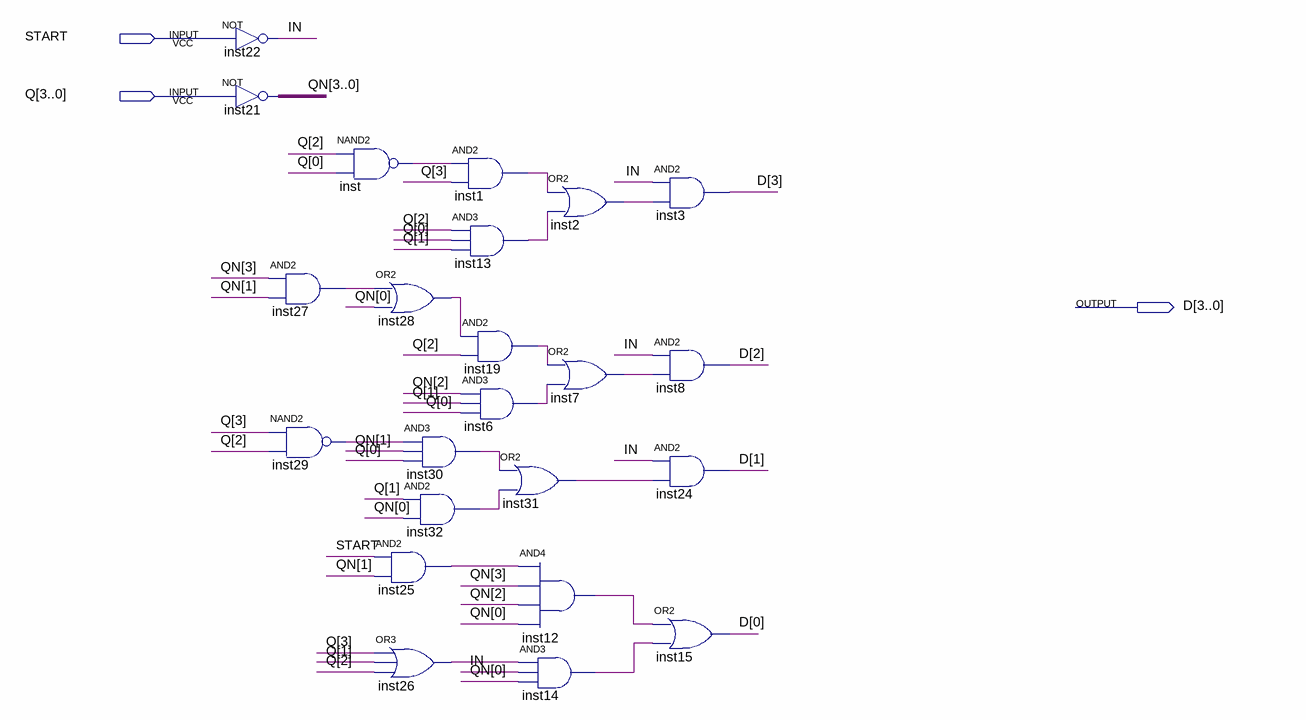
[diagram p0: schematic sheet]
// Quartus schematic NEXTSTATE.bdf as structural Verilog: 23 symbols, 3 pins
module NEXTSTATE (
  input  START,
  input  [3:0] Q,
  output [3:0] D
);

  wire IN, inst1_out, inst2_out, inst6_out, inst7_out, inst12_out, inst13_out, inst14_out, inst19_out,
       inst25_out, inst26_out, inst27_out, inst28_out, inst29_out, inst30_out, inst31_out, inst32_out,
       inst_out;
  wire [3:0] QN;

  not inst22 (IN, START);
  assign QN = ~Q;  // NOT inst21, 4 bits wide
  and inst27 (inst27_out, QN[3], QN[1]);
  nand inst29 (inst29_out, Q[3], Q[2]);
  nand inst (inst_out, Q[2], Q[0]);
  or inst28 (inst28_out, inst27_out, QN[0]);
  and inst30 (inst30_out, inst29_out, QN[1], Q[0]);
  and inst32 (inst32_out, Q[1], QN[0]);
  and inst25 (inst25_out, START, QN[1]);
  or inst26 (inst26_out, Q[3], Q[1], Q[2]);
  and inst1 (inst1_out, inst_out, Q[3]);
  and inst13 (inst13_out, Q[2], Q[0], Q[1]);
  and inst19 (inst19_out, inst28_out, Q[2]);
  and inst6 (inst6_out, QN[2], Q[1], Q[0]);
  or inst31 (inst31_out, inst30_out, inst32_out);
  and inst12 (inst12_out, inst25_out, QN[3], QN[2], QN[0]);
  and inst14 (inst14_out, inst26_out, IN, QN[0]);
  or inst2 (inst2_out, inst1_out, inst13_out);
  or inst7 (inst7_out, inst19_out, inst6_out);
  and inst3 (D[3], IN, inst2_out);
  and inst8 (D[2], IN, inst7_out);
  and inst24 (D[1], IN, inst31_out);
  or inst15 (D[0], inst12_out, inst14_out);
endmodule
